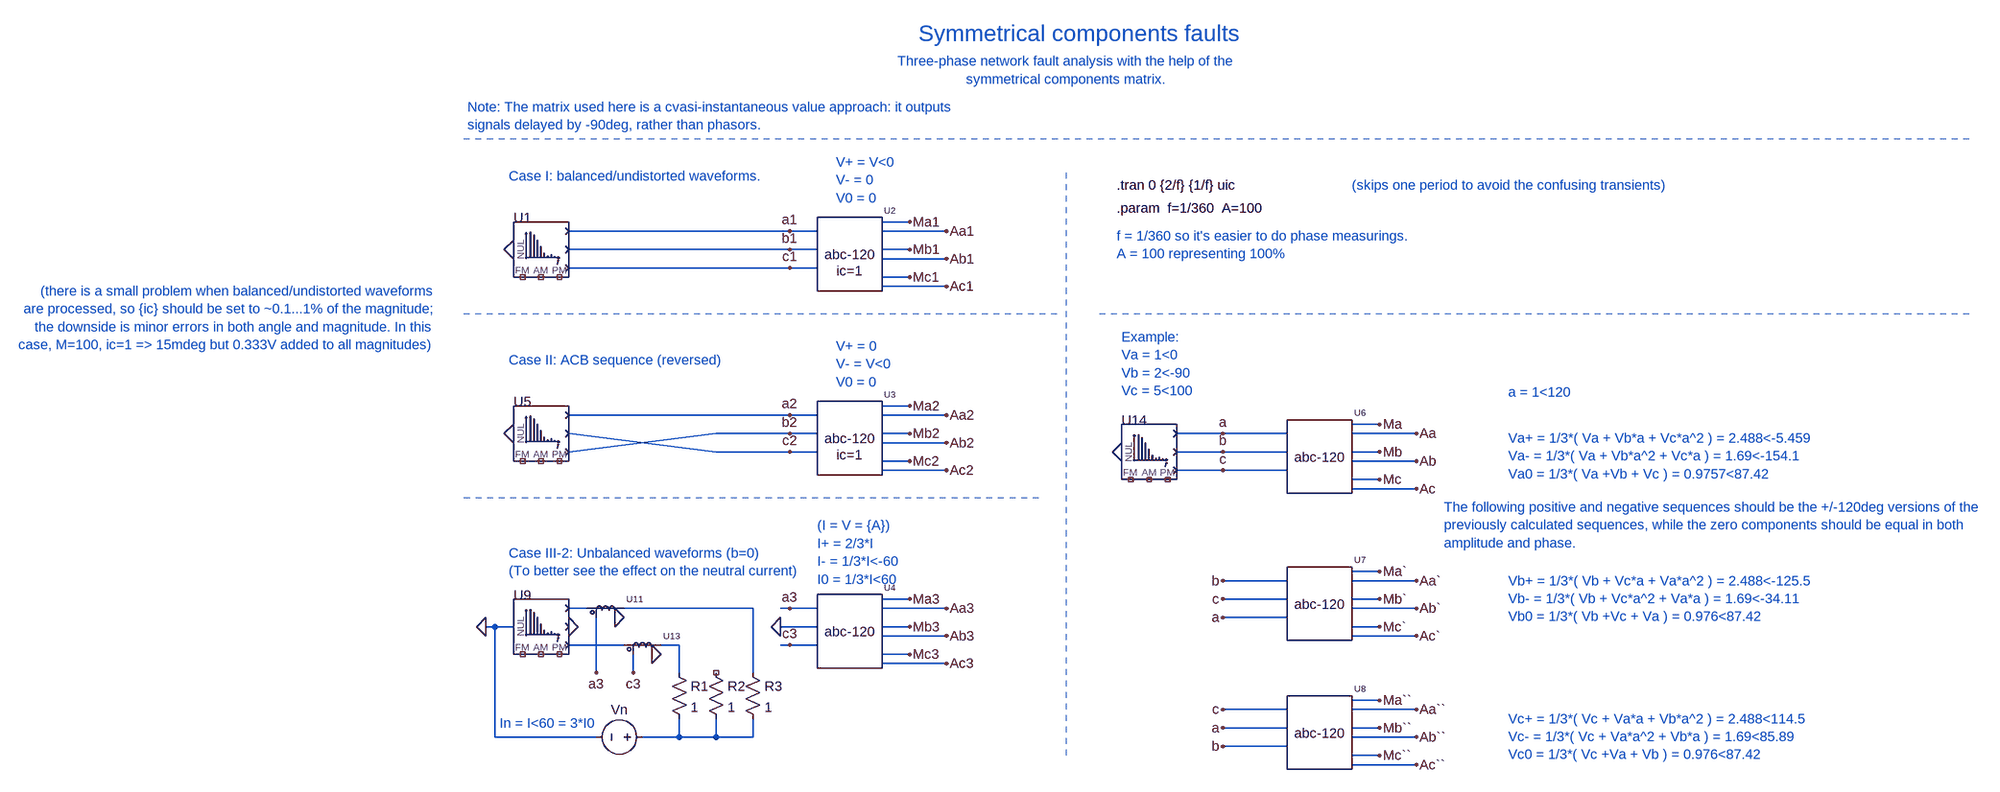
[diagram p0: schematic PC_Symmetrical_Components_Faults.asc]
PC_Symmetrical_Components_Faults.asc, the LTspice schematic file:
Version 4
SHEET 1 2540 1348
WIRE 320 96 272 96
WIRE 112 112 -272 112
WIRE 160 112 112 112
WIRE 384 112 272 112
WIRE 112 144 -272 144
WIRE 160 144 112 144
WIRE 320 144 272 144
WIRE 384 160 272 160
WIRE 112 176 -272 176
WIRE 160 176 112 176
WIRE 320 192 272 192
WIRE 384 208 272 208
WIRE 320 416 272 416
WIRE 112 432 -272 432
WIRE 160 432 112 432
WIRE 384 432 272 432
WIRE 1136 448 1088 448
WIRE 112 464 -16 464
WIRE 160 464 112 464
WIRE 320 464 272 464
WIRE 864 464 784 464
WIRE 976 464 864 464
WIRE 1200 464 1088 464
WIRE 384 480 272 480
WIRE -272 496 -16 464
WIRE -16 496 -272 464
WIRE 112 496 -16 496
WIRE 160 496 112 496
WIRE 864 496 784 496
WIRE 976 496 864 496
WIRE 1136 496 1088 496
WIRE 320 512 272 512
WIRE 1200 512 1088 512
WIRE 384 528 272 528
WIRE 864 528 784 528
WIRE 976 528 864 528
WIRE 1136 544 1088 544
WIRE 1200 560 1088 560
WIRE 1136 704 1088 704
WIRE 976 720 864 720
WIRE 1200 720 1088 720
WIRE 320 752 272 752
WIRE 976 752 864 752
WIRE 1136 752 1088 752
WIRE -240 768 -272 768
WIRE 48 768 -176 768
WIRE 112 768 96 768
WIRE 160 768 112 768
WIRE 384 768 272 768
WIRE 1200 768 1088 768
WIRE 976 784 864 784
WIRE -400 800 -416 800
WIRE -368 800 -400 800
WIRE 160 800 96 800
WIRE 320 800 272 800
WIRE 1136 800 1088 800
WIRE 384 816 272 816
WIRE 1200 816 1088 816
WIRE -176 832 -272 832
WIRE -80 832 -112 832
WIRE 112 832 96 832
WIRE 160 832 112 832
WIRE 320 848 272 848
WIRE 384 864 272 864
WIRE -224 880 -224 784
WIRE -160 880 -160 848
WIRE -80 880 -80 832
WIRE 48 880 48 768
WIRE 1136 928 1088 928
WIRE 976 944 864 944
WIRE 1200 944 1088 944
WIRE 976 976 864 976
WIRE 1136 976 1088 976
WIRE -400 992 -400 800
WIRE -224 992 -400 992
WIRE -80 992 -80 960
WIRE -80 992 -144 992
WIRE -16 992 -16 960
WIRE -16 992 -80 992
WIRE 48 992 48 960
WIRE 48 992 -16 992
WIRE 1200 992 1088 992
WIRE 976 1008 864 1008
WIRE 1136 1024 1088 1024
WIRE 1200 1040 1088 1040
FLAG 112 112 a1
FLAG 112 144 b1
FLAG 112 176 c1
FLAG 320 96 Ma1
FLAG 320 144 Mb1
FLAG 320 192 Mc1
FLAG 112 432 a2
FLAG 112 464 b2
FLAG 112 496 c2
FLAG 112 768 a3
FLAG 112 832 c3
FLAG -192 784 0
FLAG -128 848 0
FLAG -224 880 a3
FLAG -160 880 c3
FLAG 96 800 0
FLAG 864 464 a
FLAG 864 496 b
FLAG 864 528 c
FLAG 864 784 a
FLAG 864 720 b
FLAG 864 752 c
FLAG 864 976 a
FLAG 864 1008 b
FLAG 864 944 c
FLAG 384 112 Aa1
FLAG 384 160 Ab1
FLAG 384 208 Ac1
FLAG 320 416 Ma2
FLAG 320 464 Mb2
FLAG 320 512 Mc2
FLAG 384 432 Aa2
FLAG 384 480 Ab2
FLAG 384 528 Ac2
FLAG 320 752 Ma3
FLAG 320 800 Mb3
FLAG 320 848 Mc3
FLAG 384 768 Aa3
FLAG 384 816 Ab3
FLAG 384 864 Ac3
FLAG 1136 448 Ma
FLAG 1136 496 Mb
FLAG 1136 544 Mc
FLAG 1200 464 Aa
FLAG 1200 512 Ab
FLAG 1200 560 Ac
FLAG 1136 704 Ma`
FLAG 1136 752 Mb`
FLAG 1136 800 Mc`
FLAG 1200 720 Aa`
FLAG 1200 768 Ab`
FLAG 1200 816 Ac`
FLAG 1136 928 Ma``
FLAG 1136 976 Mb``
FLAG 1136 1024 Mc``
FLAG 1200 944 Aa``
FLAG 1200 992 Ab``
FLAG 1200 1040 Ac``
FLAG -272 800 0
FLAG 688 496 0
FLAG -368 144 0
FLAG -368 464 0
FLAG -416 800 0
SYMBOL 3ph_gen -320 144 R0
SYMATTR InstName U1
SYMATTR Value sym=1 f=f amp=A phi=0 Ro=1 N=1
SYMBOL res -96 864 R0
SYMATTR InstName R1
SYMATTR Value 1
SYMBOL res -32 864 R0
SYMATTR InstName R2
SYMATTR Value 1
SYMBOL res 32 864 R0
SYMATTR InstName R3
SYMATTR Value 1
SYMBOL Isense -208 768 R0
SYMATTR InstName U11
SYMBOL Isense -144 832 R0
SYMATTR InstName U13
SYMBOL 3ph_gen 736 496 R0
SYMATTR InstName U14
SYMATTR Value2 dc1=0  dc2=0  dc3=0  A1=1  A2=2  A3=5
SYMATTR Value sym=1 f=f amp=1 phi=0 Ro=1 N=1
SYMATTR SpiceLine h1=0  h2=0  h3=0  phi1=0  phi2=pi/6  phi3=-pi/9
SYMBOL 3ph_gen -320 464 R0
SYMATTR InstName U5
SYMATTR Value sym=1 f=f amp=A phi=0 Ro=1 N=1
SYMBOL 3ph_gen -320 800 R0
SYMATTR InstName U9
SYMATTR Value sym=1 f=f amp=A phi=0 Ro=0 N=1
SYMBOL sym 208 144 R0
WINDOW 40 8 37 Center 2
SYMATTR SpiceLine2 ic=1
SYMATTR SpiceLine f=f deg=1
SYMATTR InstName U2
SYMBOL sym 208 464 R0
WINDOW 40 8 37 Center 2
SYMATTR SpiceLine2 ic=1
SYMATTR SpiceLine f=f deg=1
SYMATTR InstName U3
SYMBOL sym 208 800 R0
SYMATTR SpiceLine f=f deg=1
SYMATTR InstName U4
SYMBOL sym 1024 496 R0
SYMATTR SpiceLine f=f deg=1
SYMATTR InstName U6
SYMBOL sym 1024 752 R0
SYMATTR SpiceLine f=f deg=1
SYMATTR InstName U7
SYMBOL sym 1024 976 R0
SYMATTR SpiceLine f=f deg=1
SYMATTR InstName U8
SYMBOL voltage -128 992 R90
WINDOW 0 -32 56 VBottom 2
WINDOW 3 32 56 VTop 2
SYMATTR InstName Vn
SYMATTR Value ""
TEXT 680 32 Left 2 !.tran 0 {2/f} {1/f} uic
TEXT 592 -168 Center 2 ;Three-phase network fault analysis with the help of the\nsymmetrical components matrix.
TEXT 336 -232 Left 4 ;Symmetrical components faults
TEXT -376 16 Left 2 ;Case I: balanced/undistorted waveforms.
TEXT 192 -8 Left 2 ;V+ = V<0\nV- = 0\nV0 = 0
TEXT -376 336 Left 2 ;Case II: ACB sequence (reversed)
TEXT 192 312 Left 2 ;V+ = 0\nV- = V<0\nV0 = 0
TEXT 680 72 Left 2 !.param  f=1/360  A=100
TEXT 680 120 Left 2 ;f = 1/360 so it's easier to do phase measurings.\nA = 100 representing 100%
TEXT -376 672 Left 2 ;Case III-2: Unbalanced waveforms (b=0)\n(To better see the effect on the neutral current)
TEXT 160 624 Left 2 ;(I = V = {A})\nI+ = 2/3*I\nI- = 1/3*I<-60\nI0 = 1/3*I<60
TEXT -392 968 Left 2 ;In = I<60 = 3*I0
TEXT 688 296 Left 2 ;Example:\nVa = 1<0\nVb = 2<-90\nVc = 5<100
TEXT 1360 472 Left 2 ;Va+ = 1/3*( Va + Vb*a + Vc*a^2 ) = 2.488<-5.459\nVa- = 1/3*( Va + Vb*a^2 + Vc*a ) = 1.69<-154.1\nVa0 = 1/3*( Va +Vb + Vc ) = 0.9757<87.42
TEXT 1088 32 Left 2 ;(skips one period to avoid the confusing transients)
TEXT 1360 720 Left 2 ;Vb+ = 1/3*( Vb + Vc*a + Va*a^2 ) = 2.488<-125.5\nVb- = 1/3*( Vb + Vc*a^2 + Va*a ) = 1.69<-34.11\nVb0 = 1/3*( Vb +Vc + Va ) = 0.976<87.42
TEXT 1360 392 Left 2 ;a = 1<120
TEXT 1360 960 Left 2 ;Vc+ = 1/3*( Vc + Va*a + Vb*a^2 ) = 2.488<114.5\nVc- = 1/3*( Vc + Va*a^2 + Vb*a ) = 1.69<85.89\nVc0 = 1/3*( Vc +Va + Vb ) = 0.976<87.42
TEXT 1248 592 Left 2 ;The following positive and negative sequences should be the +/-120deg versions of the\npreviously calculated sequences, while the zero components should be equal in both\namplitude and phase.
TEXT -448 -104 Left 2 ;Note: The matrix used here is a cvasi-instantaneous value approach: it outputs\nsignals delayed by -90deg, rather than phasors.
TEXT -504 216 Right 2 ;(there is a small problem when balanced/undistorted waveforms\nare processed, so {ic} should be set to ~0.1...1% of the magnitude;\nthe downside is minor errors in both angle and magnitude. In this\ncase, M=100, ic=1 => 15mdeg but 0.333V added to all magnitudes)
LINE Normal 576 256 -464 256 2
LINE Normal 544 576 -464 576 2
LINE Normal 592 1024 592 0 2
LINE Normal 2160 -48 -464 -48 2
LINE Normal 2160 256 640 256 2

The netlist it stands for:
* PC_Symmetrical_Components_Faults.asc
XU1 a1 b1 c1 0 NC_01 NC_02 NC_03 3ph_gen sym=1 f=f amp=A phi=0 Ro=1 N=1 dc1=0 dc2=0 dc3=0 A1=1 A2=1 A3=1 h1=0 h2=0 h3=0 phi1=0 phi2=0 phi3=0 a=0 b=0 c=0 d=0 e=0 p=1 q=0 xp=1 xq=1 ma=0 mb=0  ; pins 1 2 3 NUL FM AM PM
R1 N004 N005 1
R2 NC_04 N005 1
R3 N002 N005 1
XU11 N001 N002 a3 0 Isense G=1  ; pins + - out+ out-
XU13 N003 N004 c3 0 Isense G=1  ; pins + - out+ out-
XU14 a b c 0 NC_05 NC_06 NC_07 3ph_gen sym=1 f=f amp=1 phi=0 Ro=1 N=1 dc1=0  dc2=0  dc3=0  A1=1  A2=2  A3=5 h1=0  h2=0  h3=0  phi1=0  phi2=pi/6  phi3=-pi/9 a=0 b=0 c=0 d=0 e=0 p=1 q=0 xp=1 xq=1 ma=0 mb=0  ; pins 1 2 3 NUL FM AM PM
XU5 a2 c2 b2 0 NC_08 NC_09 NC_10 3ph_gen sym=1 f=f amp=A phi=0 Ro=1 N=1 dc1=0 dc2=0 dc3=0 A1=1 A2=1 A3=1 h1=0 h2=0 h3=0 phi1=0 phi2=0 phi3=0 a=0 b=0 c=0 d=0 e=0 p=1 q=0 xp=1 xq=1 ma=0 mb=0  ; pins 1 2 3 NUL FM AM PM
XU9 N001 0 N003 0 NC_11 NC_12 NC_13 3ph_gen sym=1 f=f amp=A phi=0 Ro=0 N=1 dc1=0 dc2=0 dc3=0 A1=1 A2=1 A3=1 h1=0 h2=0 h3=0 phi1=0 phi2=0 phi3=0 a=0 b=0 c=0 d=0 e=0 p=1 q=0 xp=1 xq=1 ma=0 mb=0  ; pins 1 2 3 NUL FM AM PM
XU2 a1 b1 c1 Ma1 Mb1 Mc1 Aa1 Ab1 Ac1 abc-120 f=f deg=1 ic=1  ; pins A B C M[1] M[2] M[0] A[1] A[2] A[0]
XU3 a2 b2 c2 Ma2 Mb2 Mc2 Aa2 Ab2 Ac2 abc-120 f=f deg=1 ic=1  ; pins A B C M[1] M[2] M[0] A[1] A[2] A[0]
XU4 a3 0 c3 Ma3 Mb3 Mc3 Aa3 Ab3 Ac3 abc-120 f=f deg=1  ; pins A B C M[1] M[2] M[0] A[1] A[2] A[0]
XU6 a b c Ma Mb Mc Aa Ab Ac abc-120 f=f deg=1  ; pins A B C M[1] M[2] M[0] A[1] A[2] A[0]
XU7 b c a Ma` Mb` Mc` Aa` Ab` Ac` abc-120 f=f deg=1  ; pins A B C M[1] M[2] M[0] A[1] A[2] A[0]
XU8 c a b Ma`` Mb`` Mc`` Aa`` Ab`` Ac`` abc-120 f=f deg=1  ; pins A B C M[1] M[2] M[0] A[1] A[2] A[0]
Vn N005 0
.tran 0 {2/f} {1/f} uic
* Three-phase network fault analysis with the help of the
* symmetrical components matrix.
* Symmetrical components faults
* Case I: balanced/undistorted waveforms.
* V+ = V<0
* V- = 0
* V0 = 0
* Case II: ACB sequence (reversed)
* V+ = 0
* V- = V<0
* V0 = 0
.param  f=1/360  A=100
* f = 1/360 so it's easier to do phase measurings.
* A = 100 representing 100%
* Case III-2: Unbalanced waveforms (b=0)
* (To better see the effect on the neutral current)
* (I = V = {A})
* I+ = 2/3*I
* I- = 1/3*I<-60
* I0 = 1/3*I<60
* In = I<60 = 3*I0
* Example:
* Va = 1<0
* Vb = 2<-90
* Vc = 5<100
* Va+ = 1/3*( Va + Vb*a + Vc*a^2 ) = 2.488<-5.459
* Va- = 1/3*( Va + Vb*a^2 + Vc*a ) = 1.69<-154.1
* Va0 = 1/3*( Va +Vb + Vc ) = 0.9757<87.42
* (skips one period to avoid the confusing transients)
* Vb+ = 1/3*( Vb + Vc*a + Va*a^2 ) = 2.488<-125.5
* Vb- = 1/3*( Vb + Vc*a^2 + Va*a ) = 1.69<-34.11
* Vb0 = 1/3*( Vb +Vc + Va ) = 0.976<87.42
* a = 1<120
* Vc+ = 1/3*( Vc + Va*a + Vb*a^2 ) = 2.488<114.5
* Vc- = 1/3*( Vc + Va*a^2 + Vb*a ) = 1.69<85.89
* Vc0 = 1/3*( Vc +Va + Vb ) = 0.976<87.42
* The following positive and negative sequences should be the +/-120deg versions of the
* previously calculated sequences, while the zero components should be equal in both
* amplitude and phase.
* Note: The matrix used here is a cvasi-instantaneous value approach: it outputs
* signals delayed by -90deg, rather than phasors.
* (there is a small problem when balanced/undistorted waveforms
* are processed, so {ic} should be set to ~0.1...1% of the magnitude;
* the downside is minor errors in both angle and magnitude. In this
* case, M=100, ic=1 => 15mdeg but 0.333V added to all magnitudes)
.lib pwr.sub
.lib sym.sub
.backanno
.end